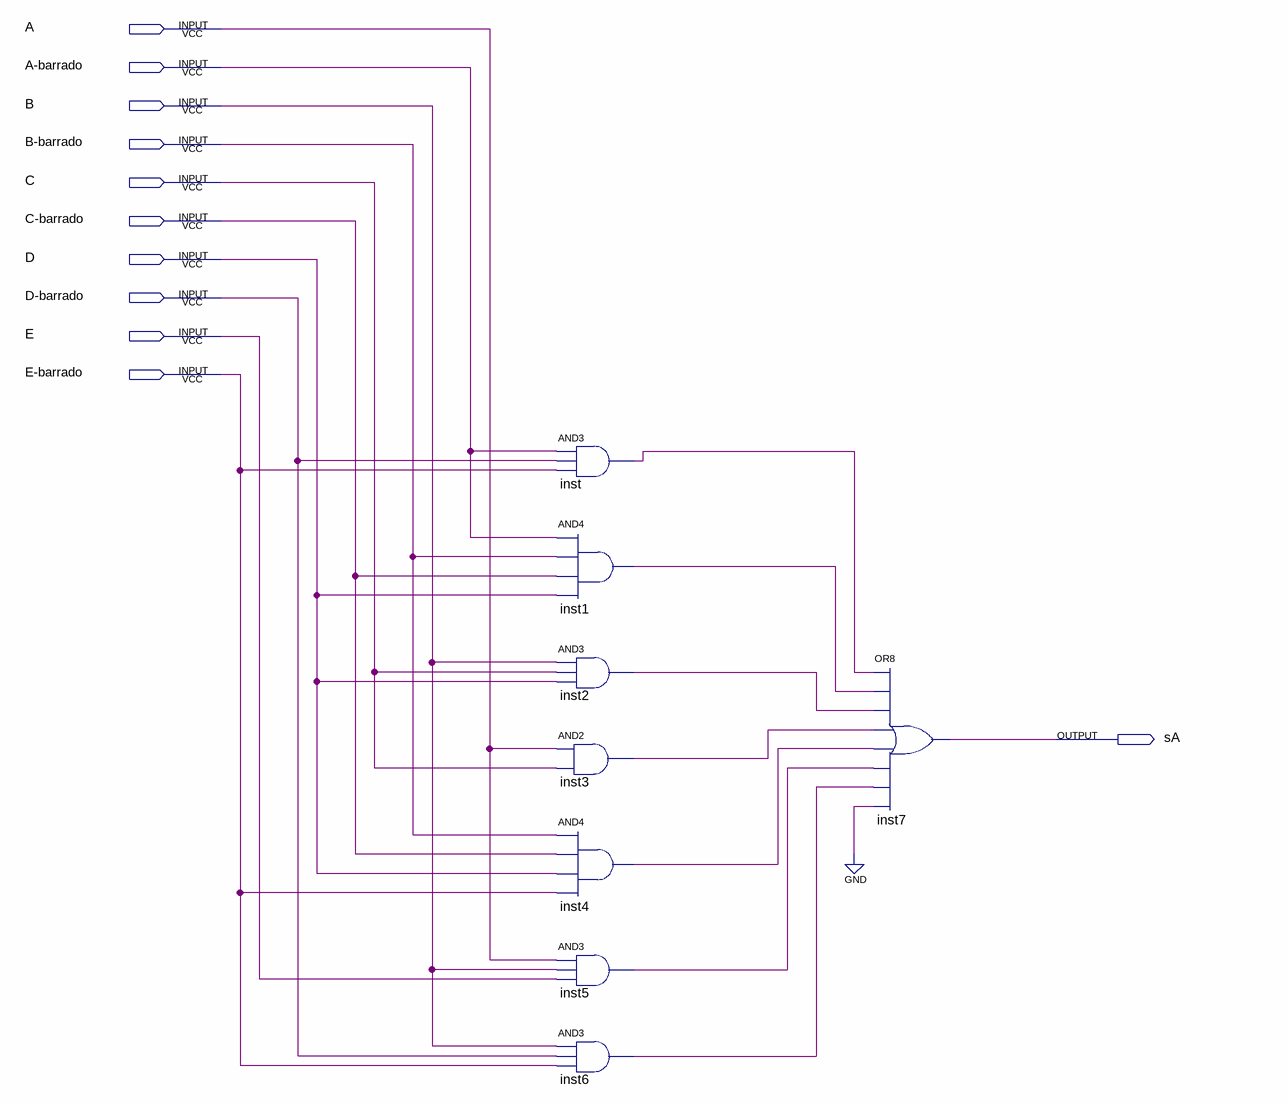
[diagram p0: schematic sheet]
// Quartus schematic saida_A.bdf as structural Verilog: 8 symbols, 11 pins
module saida_A (
  input  A,
  input  \A-barrado ,
  input  B,
  input  \B-barrado ,
  input  C,
  input  \C-barrado ,
  input  D,
  input  \D-barrado ,
  input  E,
  input  \E-barrado ,
  output sA
);

  wire inst1_out, inst2_out, inst3_out, inst4_out, inst5_out, inst6_out, inst_out;

  and inst (inst_out, \A-barrado , \D-barrado , \E-barrado );
  and inst1 (inst1_out, \A-barrado , \B-barrado , \C-barrado , D);
  and inst2 (inst2_out, B, C, D);
  and inst3 (inst3_out, A, C);
  and inst4 (inst4_out, \B-barrado , \C-barrado , D, \E-barrado );
  and inst5 (inst5_out, A, B, E);
  and inst6 (inst6_out, B, \D-barrado , \E-barrado );
  or inst7 (sA, inst_out, inst1_out, inst2_out, inst3_out, inst4_out, inst5_out, inst6_out, 1'b0);
endmodule
